# Altium project M3 ICE.PrjPcb
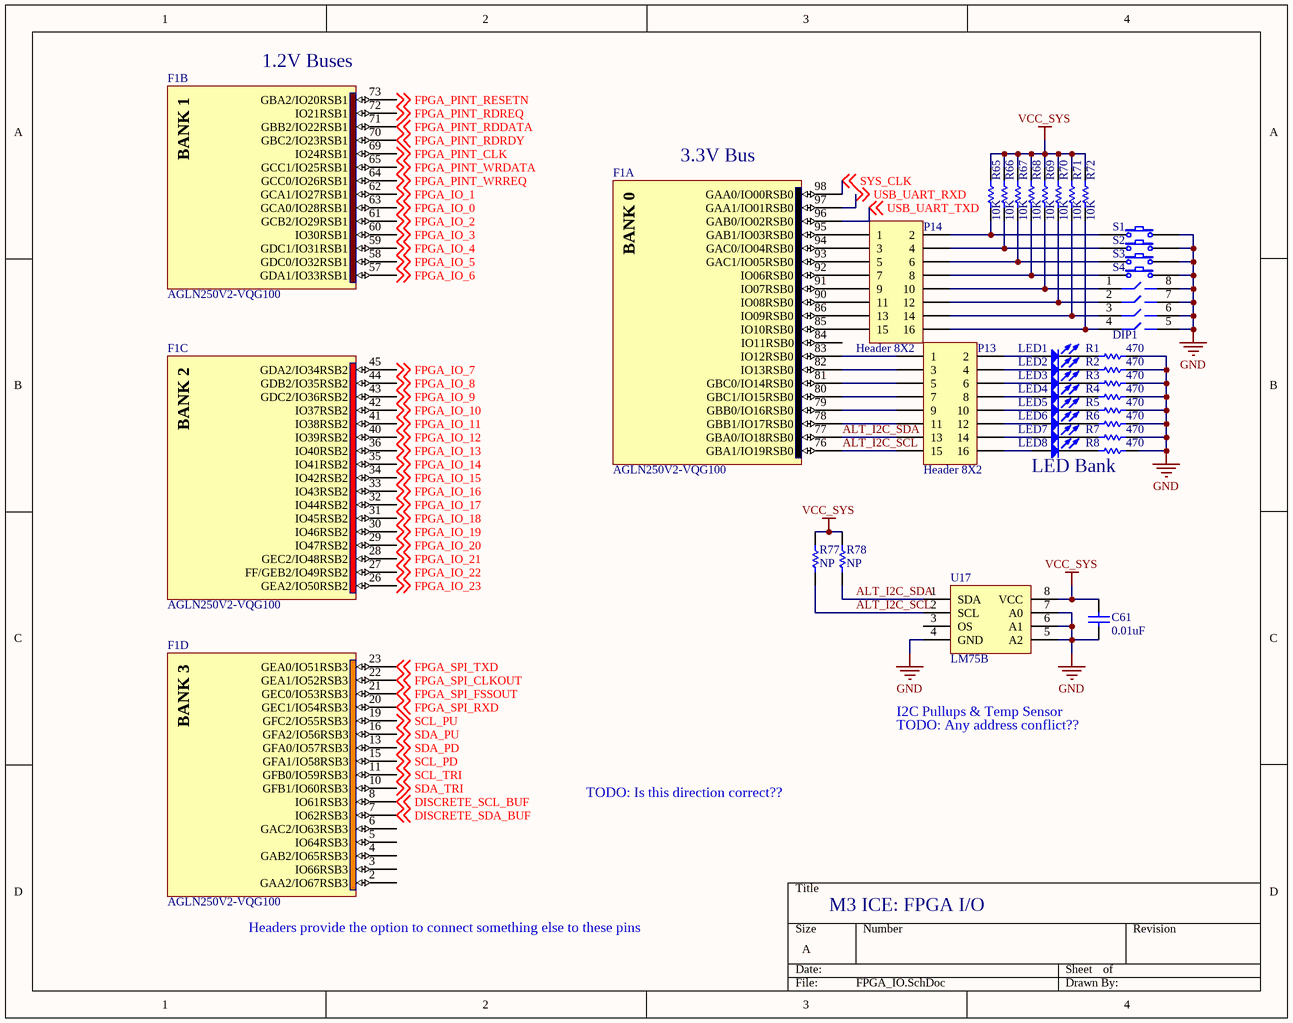
[diagram p0: FPGA_IO.SchDoc]
6 sheets, 218 parts. Net scope: global (net labels, ports and power ports of the same name join across sheets).
Board file: M3 ICE.PcbDoc
Sheets:
  FPGA_IO.SchDoc
  Power.SchDoc
  FPGA_misc.SchDoc
  USB_to_UART.SchDoc
  M3_Chip.SchDoc
  M3_Discrete_Interface.SchDoc

## Sheet FPGA_IO.SchDoc
size A

### Parts
C61  value 0.01uF  [1608[0603]]  (hidden comment: Cap Semi)
DIP1  ADE0404  [DIP-8]  (value not drawn)
F1  AGLN250V2-VQG100  [VQ100_N]  (parts A,B,C,D of 8)
LED1  LED 1206  [1206_LED]  (value not drawn)
LED2  LED 1206  [1206_LED]  (value not drawn)
LED3  LED 1206  [1206_LED]  (value not drawn)
LED4  LED 1206  [1206_LED]  (value not drawn)
LED5  LED 1206  [1206_LED]  (value not drawn)
LED6  LED 1206  [1206_LED]  (value not drawn)
LED7  LED 1206  [1206_LED]  (value not drawn)
LED8  LED 1206  [1206_LED]  (value not drawn)
P13  Header 8X2  [HDR2X8]
P14  Header 8X2  [HDR2X8]
R1  value 470  [0603]  (hidden comment: Res Chip)
R2  value 470  [0603]  (hidden comment: Res Chip)
R3  value 470  [0603]  (hidden comment: Res Chip)
R4  value 470  [0603]  (hidden comment: Res Chip)
R5  value 470  [0603]  (hidden comment: Res Chip)
R6  value 470  [0603]  (hidden comment: Res Chip)
R7  value 470  [0603]  (hidden comment: Res Chip)
R8  value 470  [0603]  (hidden comment: Res Chip)
R65  value 10K  [0603]  (hidden comment: Res Chip)
R66  value 10K  [0603]  (hidden comment: Res Chip)
R67  value 10K  [0603]  (hidden comment: Res Chip)
R68  value 10K  [0603]  (hidden comment: Res Chip)
R69  value 10K  [0603]  (hidden comment: Res Chip)
R70  value 10K  [0603]  (hidden comment: Res Chip)
R71  value 10K  [0603]  (hidden comment: Res Chip)
R72  value 10K  [0603]  (hidden comment: Res Chip)
R77  value NP  [0603]  (hidden comment: Res Chip)
R78  value NP  [0603]  (hidden comment: Res Chip)
S1  EVQ-PAE04M  [EVQPA]  (value not drawn)
S2  EVQ-PAE04M  [EVQPA]  (value not drawn)
S3  EVQ-PAE04M  [EVQPA]  (value not drawn)
S4  EVQ-PAE04M  [EVQPA]  (value not drawn)
U17  LM75B  [SO8]

### Nets
GND: C61.1 DIP1.5 DIP1.6 DIP1.7 DIP1.8 R1.1 R2.1 R3.1 R4.1 R5.1 R6.1 R7.1 R8.1 S1.2 S2.2 S3.2 S4.2 U17.4(GND) U17.5(A2) U17.6(A1) U17.7(A0)
VCC_SYS: C61.2 R65.1 R66.1 R67.1 R68.1 R69.1 R70.1 R71.1 R72.1 R77.1 R78.1 U17.8(VCC)  [project net VCC_B0]
ALT_I2C_SCL: F1.76(GBA1/IO19RSB0) P13.15 R77.2 U17.2(SCL)
ALT_I2C_SDA: F1.77(GBA0/IO18RSB0) P13.13 R78.2 U17.1(SDA)
DISCRETE_SCL_BUF: F1.8(IO61RSB3) ; off-sheet DISCRETE_SCL_BUF
DISCRETE_SDA_BUF: F1.7(IO62RSB3) ; off-sheet DISCRETE_SDA_BUF
FPGA_IO_0: F1.63(GCA0/IO28RSB1) ; off-sheet FPGA_IO_0
FPGA_IO_1: F1.62(GCA1/IO27RSB1) ; off-sheet FPGA_IO_1
FPGA_IO_2: F1.61(GCB2/IO29RSB1) ; off-sheet FPGA_IO_2
FPGA_IO_3: F1.60(IO30RSB1) ; off-sheet FPGA_IO_3
FPGA_IO_4: F1.59(GDC1/IO31RSB1) ; off-sheet FPGA_IO_4
FPGA_IO_5: F1.58(GDC0/IO32RSB1) ; off-sheet FPGA_IO_5
FPGA_IO_6: F1.57(GDA1/IO33RSB1) ; off-sheet FPGA_IO_6
FPGA_IO_7: F1.45(GDA2/IO34RSB2) ; off-sheet FPGA_IO_7
FPGA_IO_8: F1.44(GDB2/IO35RSB2) ; off-sheet FPGA_IO_8
FPGA_IO_9: F1.43(GDC2/IO36RSB2) ; off-sheet FPGA_IO_9
FPGA_IO_10: F1.42(IO37RSB2) ; off-sheet FPGA_IO_10
FPGA_IO_11: F1.41(IO38RSB2) ; off-sheet FPGA_IO_11
FPGA_IO_12: F1.40(IO39RSB2) ; off-sheet FPGA_IO_12
FPGA_IO_13: F1.36(IO40RSB2) ; off-sheet FPGA_IO_13
FPGA_IO_14: F1.35(IO41RSB2) ; off-sheet FPGA_IO_14
FPGA_IO_15: F1.34(IO42RSB2) ; off-sheet FPGA_IO_15
FPGA_IO_16: F1.33(IO43RSB2) ; off-sheet FPGA_IO_16
FPGA_IO_17: F1.32(IO44RSB2) ; off-sheet FPGA_IO_17
FPGA_IO_18: F1.31(IO45RSB2) ; off-sheet FPGA_IO_18
FPGA_IO_19: F1.30(IO46RSB2) ; off-sheet FPGA_IO_19
FPGA_IO_20: F1.29(IO47RSB2) ; off-sheet FPGA_IO_20
FPGA_IO_21: F1.28(GEC2/IO48RSB2) ; off-sheet FPGA_IO_21
FPGA_IO_22: F1.27(FF/GEB2/IO49RSB2) ; off-sheet FPGA_IO_22
FPGA_IO_23: F1.26(GEA2/IO50RSB2) ; off-sheet FPGA_IO_23
FPGA_PINT_CLK: F1.69(IO24RSB1) ; off-sheet FPGA_PINT_CLK
FPGA_PINT_RDDATA: F1.71(GBB2/IO22RSB1) ; off-sheet FPGA_PINT_RDDATA
FPGA_PINT_RDRDY: F1.70(GBC2/IO23RSB1) ; off-sheet FPGA_PINT_RDRDY
FPGA_PINT_RDREQ: F1.72(IO21RSB1) ; off-sheet FPGA_PINT_RDREQ
FPGA_PINT_RESETN: F1.73(GBA2/IO20RSB1) ; off-sheet FPGA_PINT_RESETN
FPGA_PINT_WRDATA: F1.65(GCC1/IO25RSB1) ; off-sheet FPGA_PINT_WRDATA
FPGA_PINT_WRREQ: F1.64(GCC0/IO26RSB1) ; off-sheet FPGA_PINT_WRREQ
FPGA_SPI_CLKOUT: F1.22(GEA1/IO52RSB3) ; off-sheet FPGA_SPI_CLKOUT
FPGA_SPI_FSSOUT: F1.21(GEC0/IO53RSB3) ; off-sheet FPGA_SPI_FSSOUT
FPGA_SPI_RXD: F1.20(GEC1/IO54RSB3) ; off-sheet FPGA_SPI_RXD
FPGA_SPI_TXD: F1.23(GEA0/IO51RSB3) ; off-sheet FPGA_SPI_TXD
SCL_PD: F1.15(GFA1/IO58RSB3) ; off-sheet SCL_PD
SCL_PU: F1.19(GFC2/IO55RSB3) ; off-sheet SCL_PU
SCL_TRI: F1.11(GFB0/IO59RSB3) ; off-sheet SCL_TRI
SDA_PD: F1.13(GFA0/IO57RSB3) ; off-sheet SDA_PD
SDA_PU: F1.16(GFA2/IO56RSB3) ; off-sheet SDA_PU
SDA_TRI: F1.10(GFB1/IO60RSB3) ; off-sheet SDA_TRI
SYS_CLK: F1.98(GAA0/IO00RSB0) ; off-sheet SYS_CLK
USB_UART_RXD: F1.97(GAA1/IO01RSB0) ; off-sheet USB_UART_RXD
USB_UART_TXD: F1.96(GAB0/IO02RSB0) ; off-sheet USB_UART_TXD
NetDIP1_1: DIP1.1 P14.10 R69.2
NetDIP1_2: DIP1.2 P14.12 R70.2
NetDIP1_3: DIP1.3 P14.14 R71.2
NetDIP1_4: DIP1.4 P14.16 R72.2
NetF1_78: F1.78(GBB1/IO17RSB0) P13.11
NetF1_79: F1.79(GBB0/IO16RSB0) P13.9
NetF1_80: F1.80(GBC1/IO15RSB0) P13.7
NetF1_81: F1.81(GBC0/IO14RSB0) P13.5
NetF1_82: F1.82(IO13RSB0) P13.3
NetF1_83: F1.83(IO12RSB0) P13.1
NetF1_85: F1.85(IO10RSB0) P14.15
NetF1_86: F1.86(IO09RSB0) P14.13
NetF1_90: F1.90(IO08RSB0) P14.11
NetF1_91: F1.91(IO07RSB0) P14.9
NetF1_92: F1.92(IO06RSB0) P14.7
NetF1_93: F1.93(GAC1/IO05RSB0) P14.5
NetF1_94: F1.94(GAC0/IO04RSB0) P14.3
NetF1_95: F1.95(GAB1/IO03RSB0) P14.1
NetLED1_1: LED1.1(A) P13.2
NetLED1_2: LED1.2(K) R1.2
NetLED2_1: LED2.1(A) P13.4
NetLED2_2: LED2.2(K) R2.2
NetLED3_1: LED3.1(A) P13.6
NetLED3_2: LED3.2(K) R3.2
NetLED4_1: LED4.1(A) P13.8
NetLED4_2: LED4.2(K) R4.2
NetLED5_1: LED5.1(A) P13.10
NetLED5_2: LED5.2(K) R5.2
NetLED6_1: LED6.1(A) P13.12
NetLED6_2: LED6.2(K) R6.2
NetLED7_1: LED7.1(A) P13.14
NetLED7_2: LED7.2(K) R7.2
NetLED8_1: LED8.1(A) P13.16
NetLED8_2: LED8.2(K) R8.2
NetP14_2: P14.2 R65.2 S1.1
NetP14_4: P14.4 R66.2 S2.1
NetP14_6: P14.6 R67.2 S3.1
NetP14_8: P14.8 R68.2 S4.1

Not connected (* = marked no-connect by the designer): F1 2(GAA2/IO67RSB3) 3(IO66RSB3) 4(GAB2/IO65RSB3) 5(IO64RSB3) 6(GAC2/IO63RSB3) 84(IO11RSB0); U17 3(OS)

### Notes on the sheet
- (near F1) 1.2V Buses
- (near F1) 3.3V Bus
- LED Bank
- I2C Pullups & Temp Sensor
- TODO: Any address conflict??
- TODO: Is this direction correct??
- M3 ICE: FPGA I/O
- (near F1) Headers provide the option to connect something else to these pins
- (in symbol AGLN250V2-VQG100, part A) BANK 0
- (in symbol AGLN250V2-VQG100, part B) BANK 1
- (in symbol AGLN250V2-VQG100, part C) BANK 2
- (in symbol AGLN250V2-VQG100, part D) BANK 3

### Library data of the parts
C61 = Cap Semi: Capacitor (Semiconductor SIM Model); Published: 8-Jun-2000; LatestRevisionDate: 29-May-2009; LatestRevisionNote: IPC-7351 Footprint Added.; PackageReference: C1206; Publisher: Altium Limited; PackageDescription: Chip Capacitor
DIP1 = ADE0404: 4-DIP Switch; Published: 24-Mar-1999; LatestRevisionDate: 17-Jul-2002; LatestRevisionNote: Re-released for DXP Platform.; PackageReference: DIP-8; Publisher: Altium Limited
F1 = AGLN250V2-VQG100: IGLOO nano Low-Power Flash 1.2 to 1.5V FPGA with Flash*Freeze, 68 User IOs, 250K System Gates, 1Kbit Flash ROM, 100-Pin TQFP, Commercial Grade, Pb-Free; Published: 29-May-2009; DatasheetVersion: Feb-2009; PackageVersion: v11.0, Feb-2009; PackageReference: VQ100; Publisher: Altium Limited; PackageDescription: 100-Pin Plastic Quad Flat Pack (VQ100); Code_JEDEC: MS-026-AED; ComponentLink1Description: Manufacturer Link; ComponentLink1URL: http://www.actel.com/products/igloonano/default.aspx; ComponentLink2Description: Datasheet; ComponentLink2URL: http://www.actel.com/documents/IGLOO_nano_DS.pdf
P13 P14 = Header 8X2: Header, 8-Pin, Dual row; LatestRevisionDate: 17-Jul-2002; LatestRevisionNote: Re-released for DXP Platform.; Publisher: Altium Limited
R1-R8 R65-R72 R77 R78 = Res Chip: Semiconductor Resistor; Published: 8-Jun-2000; LatestRevisionDate: 17-Jul-2002; LatestRevisionNote: Re-released for DXP Platform.; PackageReference: AXIAL-0.5; Publisher: Altium Limited; PackageDescription: Axial Device, Thru-Hole; 2 Leads; 0.5 in Pin Spacing
S1-S4 = EVQ-PAE04M: Switch Push; Published: 24-Mar-1999; LatestRevisionDate: 17-Jul-2002; LatestRevisionNote: Re-released for DXP Platform.; PackageReference: SPST-2; Publisher: Altium Limited; PackageDescription: Switch; 2 Leads
U17 = LM75B: I2C Temp Sensor

## Sheet Power.SchDoc
size A
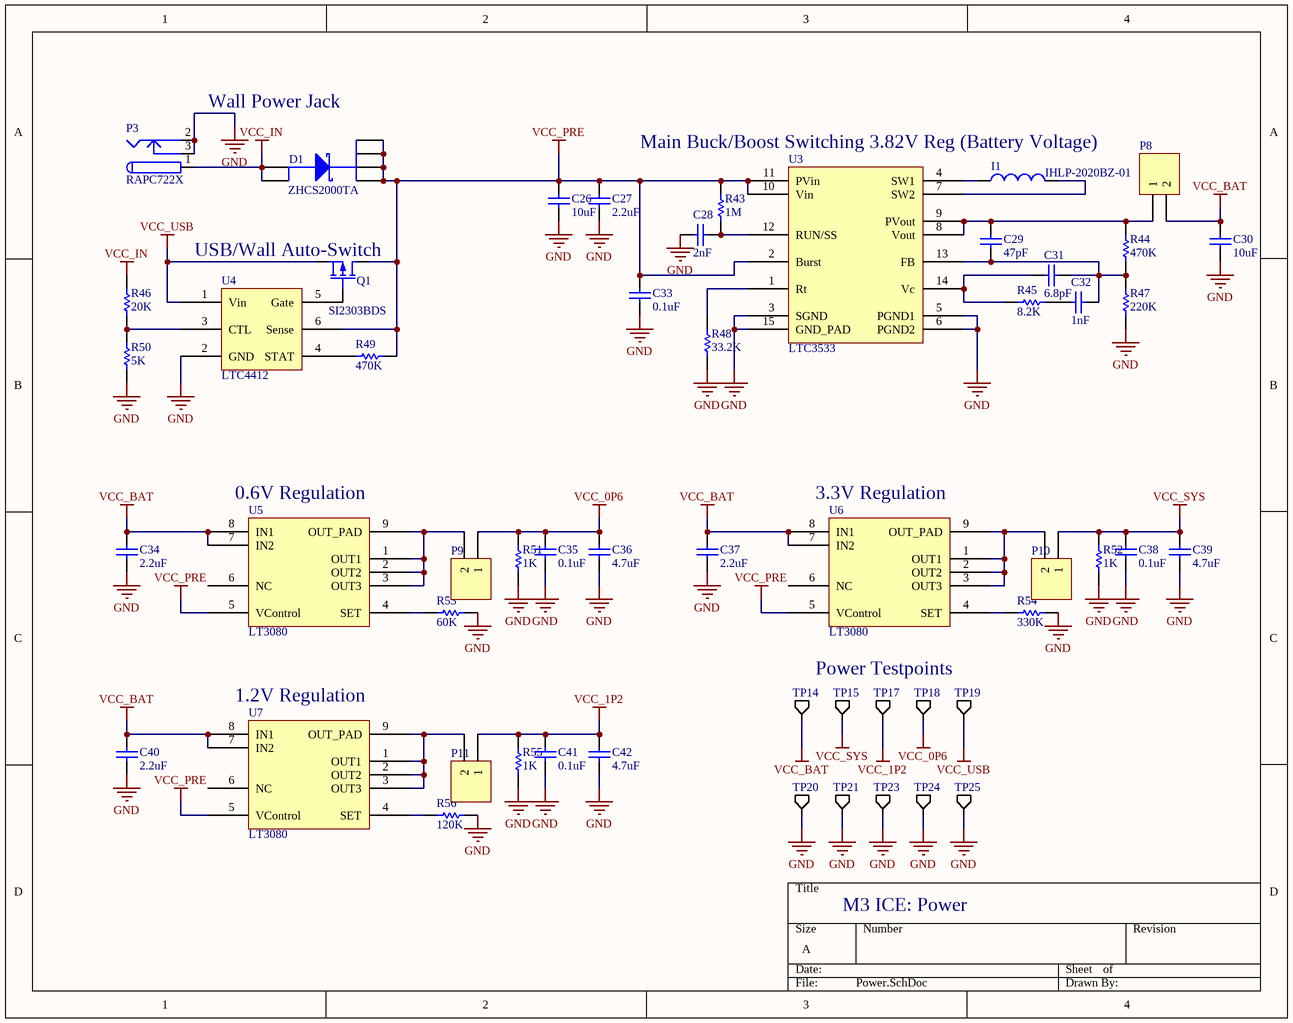
[diagram p1: Power.SchDoc]

### Parts
C26  value 10uF  [0805]  (hidden comment: Cap Chip)
C27  value 2.2uF  [1608[0603]]  (hidden comment: Cap Semi)
C28  value 2nF  [1608[0603]]  (hidden comment: Cap Semi)
C29  value 47pF  [1608[0603]]  (hidden comment: Cap Semi)
C30  value 10uF  [0805]  (hidden comment: Cap Chip)
C31  value 6.8pF  [1608[0603]]  (hidden comment: Cap Semi)
C32  value 1nF  [1608[0603]]  (hidden comment: Cap Semi)
C33  value 0.1uF  [1608[0603]]  (hidden comment: Cap Semi)
C34  value 2.2uF  [1608[0603]]  (hidden comment: Cap Semi)
C35  value 0.1uF  [1608[0603]]  (hidden comment: Cap Semi)
C36  value 4.7uF  [0805]  (hidden comment: Cap Chip)
C37  value 2.2uF  [1608[0603]]  (hidden comment: Cap Semi)
C38  value 0.1uF  [1608[0603]]  (hidden comment: Cap Semi)
C39  value 4.7uF  [0805]  (hidden comment: Cap Chip)
C40  value 2.2uF  [1608[0603]]  (hidden comment: Cap Semi)
C41  value 0.1uF  [1608[0603]]  (hidden comment: Cap Semi)
C42  value 4.7uF  [0805]  (hidden comment: Cap Chip)
D1  ZHCS2000TA  [SOT23-6_L]
I1  IHLP-2020BZ-01  [INDUCTOR_5.49mm_5.18mm]
P3  RAPC722X  [RAPC722X]
P8  Header 2  [HDR1X2]  (value not drawn)
P9  Header 2  [HDR1X2]  (value not drawn)
P10  Header 2  [HDR1X2]  (value not drawn)
P11  Header 2  [HDR1X2]  (value not drawn)
Q1  SI2303BDS  [SOT-23_N]
R43  value 1M  [0603]  (hidden comment: Res Chip)
R44  value 470K  [0603]  (hidden comment: Res Chip)
R45  value 8.2K  [0603]  (hidden comment: Res Chip)
R46  value 20K  [0603]  (hidden comment: Res Chip)
R47  value 220K  [0603]  (hidden comment: Res Chip)
R48  value 33.2K  [0603]  (hidden comment: Res Chip)
R49  value 470K  [0603]  (hidden comment: Res Chip)
R50  value 5K  [0603]  (hidden comment: Res Chip)
R51  value 1K  [0603]  (hidden comment: Res Chip)
R52  value 1K  [0603]  (hidden comment: Res Chip)
R53  value 60K  [0603]  (hidden comment: Res Chip)
R54  value 330K  [0603]  (hidden comment: Res Chip)
R55  value 1K  [0603]  (hidden comment: Res Chip)
R56  value 120K  [0603]  (hidden comment: Res Chip)
TP14  TP  [TP]  (value not drawn)
TP15  TP  [TP]  (value not drawn)
TP17  TP  [TP]  (value not drawn)
TP18  TP  [TP]  (value not drawn)
TP19  TP  [TP]  (value not drawn)
TP20  TP  [TP]  (value not drawn)
TP21  TP  [TP]  (value not drawn)
TP23  TP  [TP]  (value not drawn)
TP24  TP  [TP]  (value not drawn)
TP25  TP  [TP]  (value not drawn)
U3  LTC3533  [14-WFDFN]
U4  LTC4412  [SOT23-6_L]
U5  LT3080  [MSOP-8]
U6  LT3080  [MSOP-8]
U7  LT3080  [MSOP-8]

### Nets
GND: C26.1 C27.1 C28.2 C30.1 C33.1 C34.1 C35.1 C36.1 C37.1 C38.1 C39.1 C40.1 C41.1 C42.1 P3.2 P3.3 R47.2 R48.1 R50.1 R51.1 R52.1 R53.1 R54.1 R55.1 R56.1 TP20.1(A) TP21.1(A) TP23.1(A) TP24.1(A) TP25.1(A) U3.3(SGND) U3.5(PGND1) U3.6(PGND2) U3.15(GND_PAD) U4.2(GND)
VCC_0P6: C35.2 C36.2 P9.1 R51.2 TP18.1(A)
VCC_1P2: C41.2 C42.2 P11.1 R55.2 TP17.1(A)
VCC_BAT: C30.2 C34.2 C37.2 C40.2 P8.2 TP14.1(A) U5.7(IN2) U5.8(IN1) U6.7(IN2) U6.8(IN1) U7.7(IN2) U7.8(IN1)
VCC_IN: D1.3(A) D1.4(A) P3.1 R46.2
VCC_PRE: C26.2 C27.2 C33.2 D1.1(K) D1.2(K) D1.5(K) D1.6(K) Q1.3(D) R43.2 R49.1 U3.2(Burst) U3.10(Vin) U3.11(PVin) U4.6(Sense) U5.5(VControl) U6.5(VControl) U7.5(VControl)
VCC_SYS: C38.2 C39.2 P10.1 R52.2 TP15.1(A)  [project net VCC_B0]
VCC_USB: Q1.2(S) TP19.1(A) U4.1(Vin)
NetC28_1: C28.1 R43.1 U3.12(RUN/SS)
NetC29_1: C29.1 C31.1 C32.1 R44.1 R47.1 U3.13(FB)
NetC29_2: C29.2 P8.1 R44.2 U3.8(Vout) U3.9(PVout)
NetC31_2: C31.2 R45.2 U3.14(Vc)
NetC32_2: C32.2 R45.1
NetI1_1: I1.1 U3.4(SW1)
NetI1_2: I1.2 U3.7(SW2)
NetP9_2: P9.2 U5.1(OUT1) U5.2(OUT2) U5.3(OUT3) U5.9(OUT_PAD)
NetP10_2: P10.2 U6.1(OUT1) U6.2(OUT2) U6.3(OUT3) U6.9(OUT_PAD)
NetP11_2: P11.2 U7.1(OUT1) U7.2(OUT2) U7.3(OUT3) U7.9(OUT_PAD)
NetQ1_1: Q1.1(G) U4.5(Gate)
NetR46_1: R46.1 R50.2 U4.3(CTL)
NetR48_2: R48.2 U3.1(Rt)
NetR49_2: R49.2 U4.4(STAT)
NetR53_2: R53.2 U5.4(SET)
NetR54_2: R54.2 U6.4(SET)
NetR56_2: R56.2 U7.4(SET)

Not connected (* = marked no-connect by the designer): U5 6(NC); U6 6(NC); U7 6(NC)

### Notes on the sheet
- Wall Power Jack
- Main Buck/Boost Switching 3.82V Reg (Battery Voltage)
- (near Q1) USB/Wall Auto-Switch
- (near U5) 0.6V Regulation
- (near U6) 3.3V Regulation
- (near U7) 1.2V Regulation
- Power Testpoints
- M3 ICE: Power

### Library data of the parts
C26 C30 C36 C39 C42 = Cap Chip: Capacitor (Semiconductor SIM Model); Published: 8-Jun-2000; LatestRevisionDate: 29-May-2009; LatestRevisionNote: IPC-7351 Footprint Added.; PackageReference: C1206; Publisher: Altium Limited; PackageDescription: Chip Capacitor
C27-C29 C31-C35 C37 C38 C40 C41 = Cap Semi: Capacitor (Semiconductor SIM Model); Published: 8-Jun-2000; LatestRevisionDate: 29-May-2009; LatestRevisionNote: IPC-7351 Footprint Added.; PackageReference: C1206; Publisher: Altium Limited; PackageDescription: Chip Capacitor
D1 = ZHCS2000TA: Schottky Diode; Published: 8-Jun-2000; LatestRevisionDate: 17-Jul-2002; LatestRevisionNote: Re-released for DXP Platform.; PackageReference: SMB; Publisher: Altium Limited; PackageDescription: DO-214-AA/SMB; 2 C-Bend Leads; Body 5.3 x 3.6 mm, inc. leads (LxW); Code_JEDEC: DO-214-AA
I1 = Inductor IHLP-2020BZ-01: IHLP2020BZER2R2M01
P3 = RAPC722X: CONN POWERJACK MINI R/A T/H
P8-P11 = Header 2: Header, 2-Pin; LatestRevisionDate: 17-Jul-2002; LatestRevisionNote: Re-released for DXP Platform.; Publisher: Altium Limited
Q1 = SI2303BDS: P-Channel MOSFET
R43-R56 = Res Chip: Semiconductor Resistor; Published: 8-Jun-2000; LatestRevisionDate: 17-Jul-2002; LatestRevisionNote: Re-released for DXP Platform.; PackageReference: AXIAL-0.5; Publisher: Altium Limited; PackageDescription: Axial Device, Thru-Hole; 2 Leads; 0.5 in Pin Spacing

## Sheet FPGA_misc.SchDoc
size A
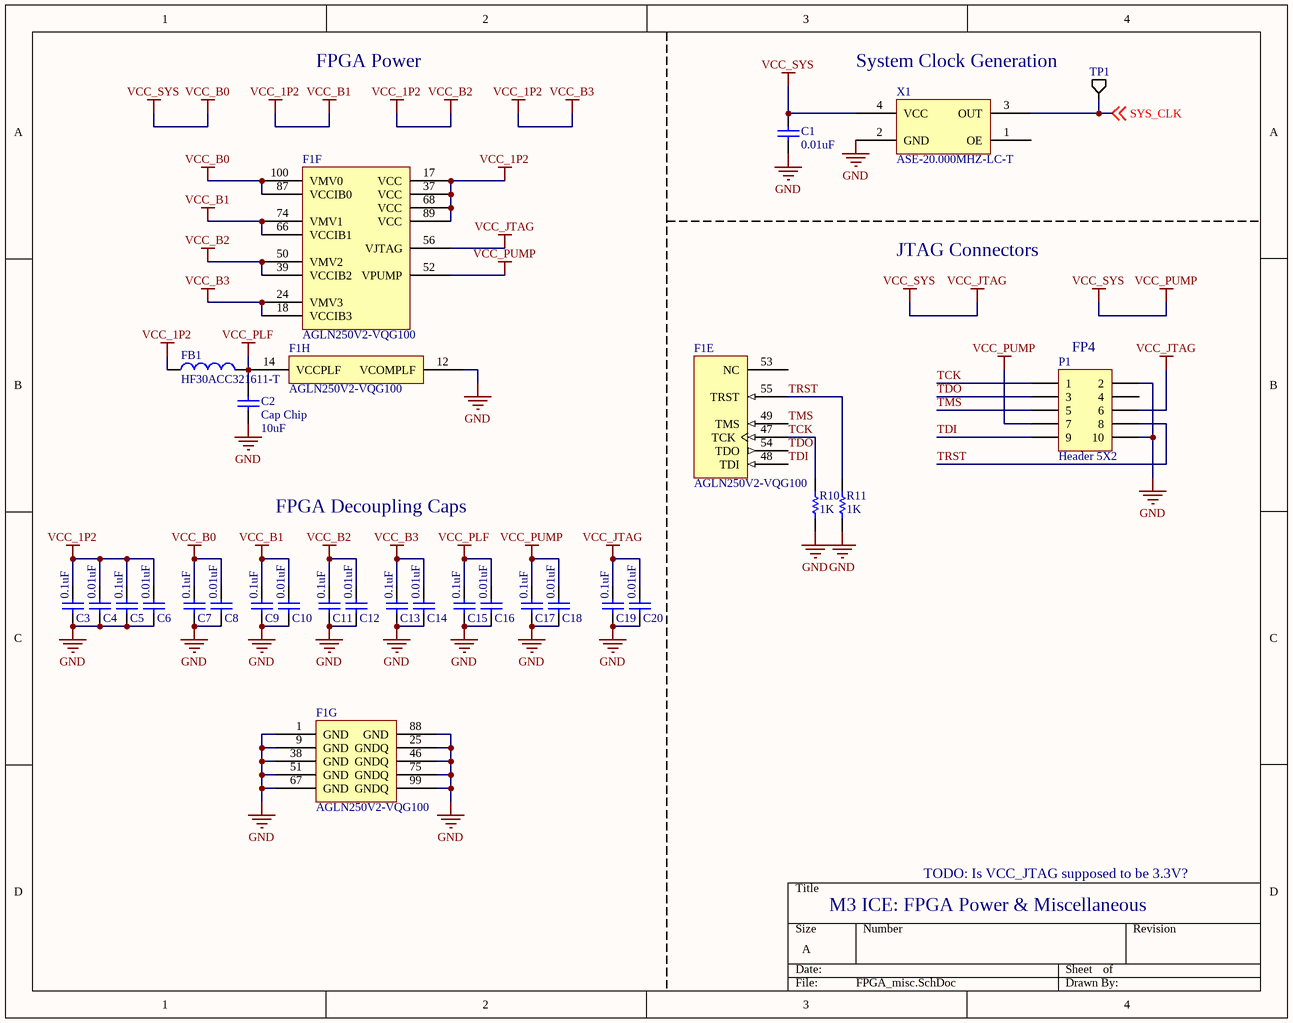
[diagram p2: FPGA_misc.SchDoc]

### Parts
C1  value 0.01uF  [1608[0603]]  (hidden comment: Cap Semi)
C2  Cap Chip  value 10uF  [0805]
C3  value 0.1uF  [1608[0603]]  (hidden comment: Cap Semi)
C4  value 0.01uF  [1608[0603]]  (hidden comment: Cap Semi)
C5  value 0.1uF  [1608[0603]]  (hidden comment: Cap Semi)
C6  value 0.01uF  [1608[0603]]  (hidden comment: Cap Semi)
C7  value 0.1uF  [1608[0603]]  (hidden comment: Cap Semi)
C8  value 0.01uF  [1608[0603]]  (hidden comment: Cap Semi)
C9  value 0.1uF  [1608[0603]]  (hidden comment: Cap Semi)
C10  value 0.01uF  [1608[0603]]  (hidden comment: Cap Semi)
C11  value 0.1uF  [1608[0603]]  (hidden comment: Cap Semi)
C12  value 0.01uF  [1608[0603]]  (hidden comment: Cap Semi)
C13  value 0.1uF  [1608[0603]]  (hidden comment: Cap Semi)
C14  value 0.01uF  [1608[0603]]  (hidden comment: Cap Semi)
C15  value 0.1uF  [1608[0603]]  (hidden comment: Cap Semi)
C16  value 0.01uF  [1608[0603]]  (hidden comment: Cap Semi)
C17  value 0.1uF  [1608[0603]]  (hidden comment: Cap Semi)
C18  value 0.01uF  [1608[0603]]  (hidden comment: Cap Semi)
C19  value 0.1uF  [1608[0603]]  (hidden comment: Cap Semi)
C20  value 0.01uF  [1608[0603]]  (hidden comment: Cap Semi)
F1  AGLN250V2-VQG100  [VQ100_N]  (parts E,F,G,H of 8)
FB1  HF30ACC321611-T  [Ferrite_Bead_3.2mm_1.6mm]
P1  Header 5X2  [HDR2X5]
R10  value 1K  [0603]  (hidden comment: Res Chip)
R11  value 1K  [0603]  (hidden comment: Res Chip)
TP1  TP  [TP]  (value not drawn)
X1  ASE-20.000MHZ-LC-T  [CRYSTAL_3.2mm_2.5mm]

### Nets
GND: C1.1 C2.1 C3.1 C4.1 C5.1 C6.1 C7.1 C8.1 C9.1 C10.1 C11.1 C12.1 C13.1 C14.1 C15.1 C16.1 C17.1 C18.1 C19.1 C20.1 F1.1(GND) F1.9(GND) F1.12(VCOMPLF) F1.25(GNDQ) F1.38(GND) F1.46(GNDQ) F1.51(GND) F1.67(GND) F1.75(GNDQ) F1.88(GND) F1.99(GNDQ) P1.2 P1.10 R10.2 R11.2 X1.2(GND)
VCC_1P2: C3.2 C4.2 C5.2 C6.2 C9.2 C10.2 C11.2 C12.2 C13.2 C14.2 F1.17(VCC) F1.18(VCCIB3) F1.24(VMV3) F1.37(VCC) F1.39(VCCIB2) F1.50(VMV2) F1.66(VCCIB1) F1.68(VCC) F1.74(VMV1) F1.89(VCC) FB1.1  [also labelled VCC_B1, VCC_B2, VCC_B3]
VCC_B0: C1.2 C7.2 C8.2 C17.2 C18.2 C19.2 C20.2 F1.52(VPUMP) F1.56(VJTAG) F1.87(VCCIB0) F1.100(VMV0) P1.6 P1.7 X1.4(VCC)  [also labelled VCC_JTAG, VCC_PUMP, VCC_SYS]
VCC_PLF: C2.2 C15.2 C16.2 F1.14(VCCPLF) FB1.2
SYS_CLK: TP1.1(A) X1.3(OUT) ; off-sheet SYS_CLK
TCK: F1.47(TCK) P1.1 R10.1
TDI: F1.48(TDI) P1.9
TDO: F1.54(TDO) P1.3
TMS: F1.49(TMS) P1.5
TRST: F1.55(TRST) P1.8 R11.1

Not connected (* = marked no-connect by the designer): F1 53(NC); P1 4; X1 1(OE)

### Notes on the sheet
- FPGA Power
- System Clock Generation
- JTAG Connectors
- (near P1) FP4
- FPGA Decoupling Caps
- M3 ICE: FPGA Power & Miscellaneous
- TODO: Is VCC_JTAG supposed to be 3.3V?

### Library data of the parts
C1 C3-C20 = Cap Semi: Capacitor (Semiconductor SIM Model); Published: 8-Jun-2000; LatestRevisionDate: 29-May-2009; LatestRevisionNote: IPC-7351 Footprint Added.; PackageReference: C1206; Publisher: Altium Limited; PackageDescription: Chip Capacitor
C2 = Cap Chip: Capacitor (Semiconductor SIM Model); Published: 8-Jun-2000; LatestRevisionDate: 29-May-2009; LatestRevisionNote: IPC-7351 Footprint Added.; PackageReference: C1206; Publisher: Altium Limited; PackageDescription: Chip Capacitor
F1 = AGLN250V2-VQG100: as F1 on sheet FPGA_IO; Published: 29-May-2009; DatasheetVersion: Feb-2009; PackageVersion: v11.0, Feb-2009; PackageReference: VQ100; Publisher: Altium Limited; PackageDescription: 100-Pin Plastic Quad Flat Pack (VQ100); Code_JEDEC: MS-026-AED; ComponentLink1Description: Manufacturer Link; ComponentLink1URL: http://www.actel.com/products/igloonano/default.aspx; ComponentLink2Description: Datasheet; ComponentLink2URL: http://www.actel.com/documents/IGLOO_nano_DS.pdf
FB1 = Ferrite Bead HF30ACC321611-T
P1 = Header 5X2: Header, 5-Pin, Dual row; LatestRevisionDate: 17-Jul-2002; LatestRevisionNote: Re-released for DXP Platform.; Publisher: Altium Limited
R10 R11 = Res Chip: Semiconductor Resistor; Published: 8-Jun-2000; LatestRevisionDate: 17-Jul-2002; LatestRevisionNote: Re-released for DXP Platform.; PackageReference: AXIAL-0.5; Publisher: Altium Limited; PackageDescription: Axial Device, Thru-Hole; 2 Leads; 0.5 in Pin Spacing

## Sheet USB_to_UART.SchDoc
size A
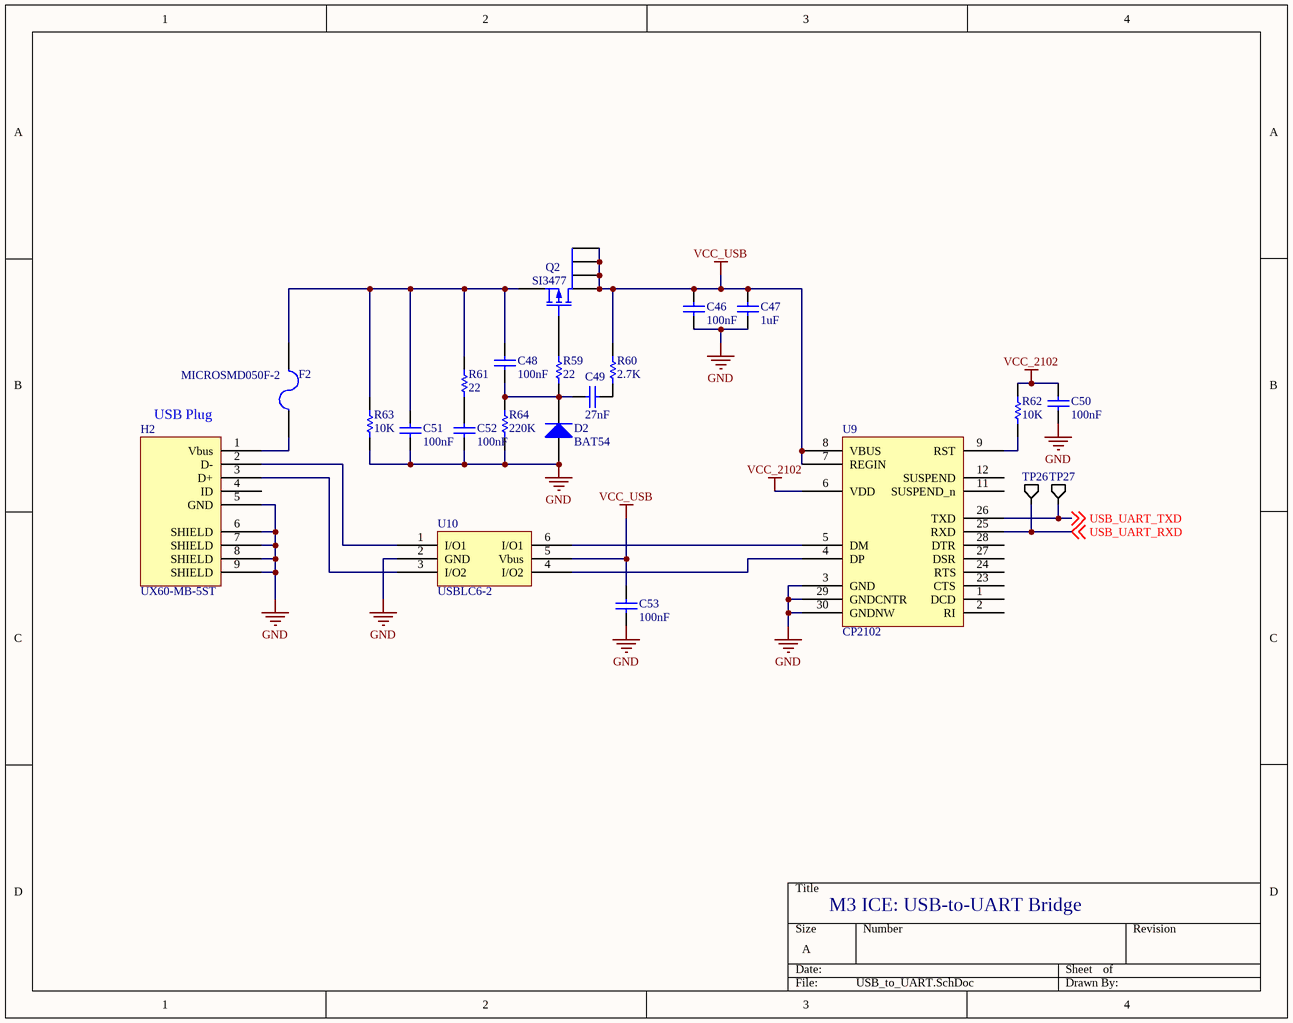
[diagram p3: USB_to_UART.SchDoc]

### Parts
C46  value 100nF  [1608[0603]]  (hidden comment: Cap Semi)
C47  value 1uF  [1608[0603]]  (hidden comment: Cap Semi)
C48  value 100nF  [1608[0603]]  (hidden comment: Cap Semi)
C49  value 27nF  [1608[0603]]  (hidden comment: Cap Semi)
C50  value 100nF  [1608[0603]]  (hidden comment: Cap Semi)
C51  value 100nF  [1608[0603]]  (hidden comment: Cap Semi)
C52  value 100nF  [1608[0603]]  (hidden comment: Cap Semi)
C53  value 100nF  [1608[0603]]  (hidden comment: Cap Semi)
D2  BAT54  [SOT-23_N]
F2  MICROSMD050F-2  [1210]
H2  UX60-MB-5ST  [USB Mini-B]
Q2  SI3477  [TSOP-6]
R59  value 22  [0603]  (hidden comment: Res Chip)
R60  value 2.7K  [0603]  (hidden comment: Res Chip)
R61  value 22  [0603]  (hidden comment: Res Chip)
R62  value 10K  [0603]  (hidden comment: Res Chip)
R63  value 10K  [0603]  (hidden comment: Res Chip)
R64  value 220K  [0603]  (hidden comment: Res Chip)
TP26  TP  [TP]  (value not drawn)
TP27  TP  [TP]  (value not drawn)
U9  CP2102  [QFN-28]
U10  USBLC6-2  [SOT23-6_L]

### Nets
GND: C46.1 C47.1 C50.1 C51.1 C52.1 C53.1 D2.1(A) H2.5(GND) H2.6(SHIELD) H2.7(SHIELD) H2.8(SHIELD) H2.9(SHIELD) R63.1 R64.1 U9.3(GND) U9.29(GNDCNTR) U9.30(GNDNW) U10.2(GND)
VCC_2102: C50.2 R62.2 U9.6(VDD)
VCC_USB: C46.2 C47.2 C53.2 Q2.1(D) Q2.2(D) Q2.5(D) Q2.6(D) R60.2 U9.7(REGIN) U9.8(VBUS) U10.5(Vbus)
USB_UART_RXD: TP26.1(A) U9.25(RXD) ; off-sheet USB_UART_RXD
USB_UART_TXD: TP27.1(A) U9.26(TXD) ; off-sheet USB_UART_TXD
NetC48_1: C48.1 C49.2 D2.3(K) R59.1 R64.2
NetC48_2: C48.2 C51.2 F2.2 Q2.4(S) R61.2 R63.2
NetC49_1: C49.1 R60.1
NetC52_2: C52.2 R61.1
NetF2_1: F2.1 H2.1(Vbus)
NetH2_2: H2.2(D-) U10.1(I/O1)
NetH2_3: H2.3(D+) U10.3(I/O2)
NetQ2_3: Q2.3(G) R59.2
NetR62_1: R62.1 U9.9(RST)
NetU9_4: U9.4(DP) U10.4(I/O2)
NetU9_5: U9.5(DM) U10.6(I/O1)

Not connected (* = marked no-connect by the designer): H2 4(ID); U9 1(DCD) 2(RI) 11(SUSPEND_n) 12(SUSPEND) 23(CTS) 24(RTS) 27(DSR) 28(DTR)

### Notes on the sheet
- (near H2) USB Plug
- M3 ICE: USB-to-UART Bridge

### Library data of the parts
C46-C53 = Cap Semi: Capacitor (Semiconductor SIM Model); Published: 8-Jun-2000; LatestRevisionDate: 29-May-2009; LatestRevisionNote: IPC-7351 Footprint Added.; PackageReference: C1206; Publisher: Altium Limited; PackageDescription: Chip Capacitor
D2 = Diode BAT18: Low-Loss RF Switching Diode; Note: Pin 2 is not connected and not drawn.; Published: 21-Mar-2003; LatestRevisionDate: 29-May-2009; LatestRevisionNote: IPC-7351 Footprint Added.; DatasheetVersion: Oct-1999; PackageVersion: Sep-2001; PackageReference: SOT-23; Publisher: Altium Limited; PackageDescription: 3-Pin SOT-23 Package 0.95 mm Pitch, 2.5 mm Lead Span; ComponentLink1Description: Manufacturer Link; ComponentLink1URL: http://www.infineon.com/
F2 = Fuse MICROSMD050F-2: POLYSWITCH 0.50A RESET FUSE SMD; Published: 8-Jun-2000; LatestRevisionDate: 17-Jul-2002; LatestRevisionNote: Re-released for DXP Platform.; PackageReference: PIN-W2/E2.8; Publisher: Altium Limited; PackageDescription: Thru-Hole; 2 Leads
H2 = UX60-MB-5ST: USB mini-B
Q2 = SI3477: P-Channel MOSFET; Published: 8-Jun-2000; LatestRevisionDate: 17-Jul-2002; LatestRevisionNote: Re-released for DXP Platform.; PackageVersion: 1995/1996; PackageReference: E3; Publisher: Altium Limited; PackageDescription: TO, Flat Index; 3 In-Line, Axial Leads; Body Dia. 4.6mm; Lead Dia. 0.5 mm (max)
R59-R64 = Res Chip: Semiconductor Resistor; Published: 8-Jun-2000; LatestRevisionDate: 17-Jul-2002; LatestRevisionNote: Re-released for DXP Platform.; PackageReference: AXIAL-0.5; Publisher: Altium Limited; PackageDescription: Axial Device, Thru-Hole; 2 Leads; 0.5 in Pin Spacing
U10 = USBLC6-2: USB ESD Protection

## Sheet M3_Chip.SchDoc
size A
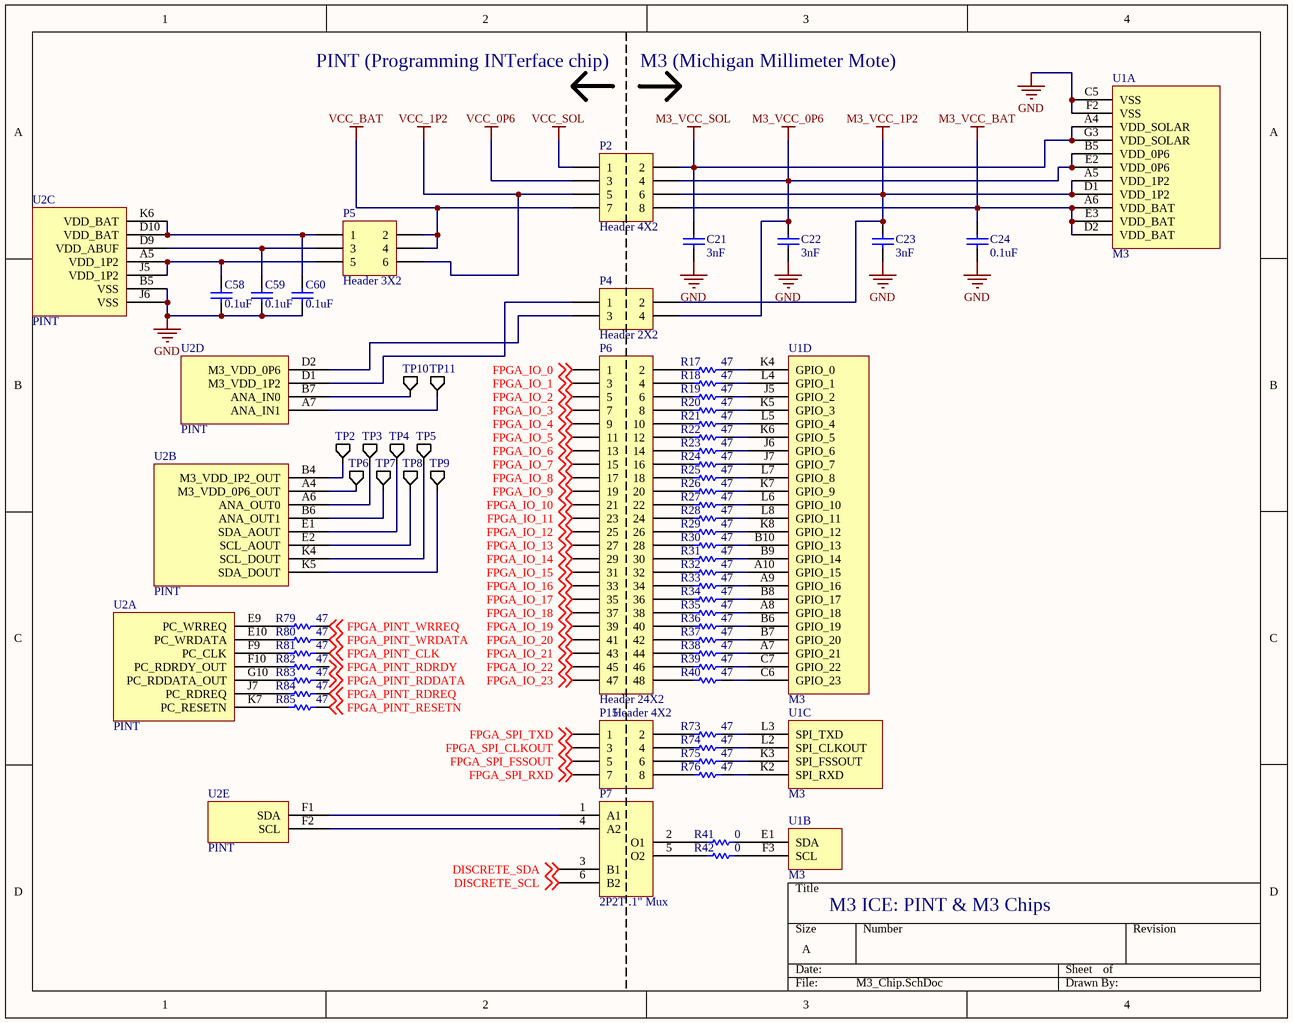
[diagram p4: M3_Chip.SchDoc]

### Parts
C21  value 3nF  [1608[0603]]  (hidden comment: Cap Semi)
C22  value 3nF  [1608[0603]]  (hidden comment: Cap Semi)
C23  value 3nF  [1608[0603]]  (hidden comment: Cap Semi)
C24  value 0.1uF  [1608[0603]]  (hidden comment: Cap Semi)
C58  value 0.1uF  [1608[0603]]  (hidden comment: Cap Semi)
C59  value 0.1uF  [1608[0603]]  (hidden comment: Cap Semi)
C60  value 0.1uF  [1608[0603]]  (hidden comment: Cap Semi)
P2  Header 4X2  [HDR2X4]
P4  Header 2X2  [HDR2X2]
P5  Header 3X2  [HDR2X3]
P6  Header 24X2  [HDR2X24]
P7  2P2T .1" Mux  [HDR3x2]
P15  Header 4X2  [HDR2X4]
R17  value 47  [0603]  (hidden comment: Res Chip)
R18  value 47  [0603]  (hidden comment: Res Chip)
R19  value 47  [0603]  (hidden comment: Res Chip)
R20  value 47  [0603]  (hidden comment: Res Chip)
R21  value 47  [0603]  (hidden comment: Res Chip)
R22  value 47  [0603]  (hidden comment: Res Chip)
R23  value 47  [0603]  (hidden comment: Res Chip)
R24  value 47  [0603]  (hidden comment: Res Chip)
R25  value 47  [0603]  (hidden comment: Res Chip)
R26  value 47  [0603]  (hidden comment: Res Chip)
R27  value 47  [0603]  (hidden comment: Res Chip)
R28  value 47  [0603]  (hidden comment: Res Chip)
R29  value 47  [0603]  (hidden comment: Res Chip)
R30  value 47  [0603]  (hidden comment: Res Chip)
R31  value 47  [0603]  (hidden comment: Res Chip)
R32  value 47  [0603]  (hidden comment: Res Chip)
R33  value 47  [0603]  (hidden comment: Res Chip)
R34  value 47  [0603]  (hidden comment: Res Chip)
R35  value 47  [0603]  (hidden comment: Res Chip)
R36  value 47  [0603]  (hidden comment: Res Chip)
R37  value 47  [0603]  (hidden comment: Res Chip)
R38  value 47  [0603]  (hidden comment: Res Chip)
R39  value 47  [0603]  (hidden comment: Res Chip)
R40  value 47  [0603]  (hidden comment: Res Chip)
R41  value 0  [0603]  (hidden comment: Res Chip)
R42  value 0  [0603]  (hidden comment: Res Chip)
R73  value 47  [0603]  (hidden comment: Res Chip)
R74  value 47  [0603]  (hidden comment: Res Chip)
R75  value 47  [0603]  (hidden comment: Res Chip)
R76  value 47  [0603]  (hidden comment: Res Chip)
R79  value 47  [0603]  (hidden comment: Res Chip)
R80  value 47  [0603]  (hidden comment: Res Chip)
R81  value 47  [0603]  (hidden comment: Res Chip)
R82  value 47  [0603]  (hidden comment: Res Chip)
R83  value 47  [0603]  (hidden comment: Res Chip)
R84  value 47  [0603]  (hidden comment: Res Chip)
R85  value 47  [0603]  (hidden comment: Res Chip)
TP2  TP  [TP]  (value not drawn)
TP3  TP  [TP]  (value not drawn)
TP4  TP  [TP]  (value not drawn)
TP5  TP  [TP]  (value not drawn)
TP6  TP  [TP]  (value not drawn)
TP7  TP  [TP]  (value not drawn)
TP8  TP  [TP]  (value not drawn)
TP9  TP  [TP]  (value not drawn)
TP10  TP  [TP]  (value not drawn)
TP11  TP  [TP]  (value not drawn)
U1  M3  [CPGA-84]  (parts A,B,C,D of 4)
U2  PINT  [CPGA-65]  (parts A,B,C,D,E of 5)

### Nets
GND: C21.1 C22.1 C23.1 C24.1 C58.1 C59.1 C60.1 U1.C5(VSS) U1.F2(VSS) U2.B5(VSS) U2.J6(VSS)
M3_VCC_0P6: C22.2 P2.4 P4.4 U1.B5(VDD_0P6) U1.E2(VDD_0P6)
M3_VCC_1P2: C23.2 P2.6 P4.2 U1.A5(VDD_1P2) U1.D1(VDD_1P2)
M3_VCC_BAT: C24.2 P2.8 U1.A6(VDD_BAT) U1.D2(VDD_BAT) U1.E3(VDD_BAT)
M3_VCC_SOL: C21.2 P2.2 U1.A4(VDD_SOLAR) U1.G3(VDD_SOLAR)
VCC_0P6: P2.3
VCC_1P2: P2.5 P5.6
VCC_BAT: P2.7 P5.2 P5.4
VCC_SOL: P2.1
DISCRETE_SCL: P7.6(B2) ; off-sheet DISCRETE_SCL
DISCRETE_SDA: P7.3(B1) ; off-sheet DISCRETE_SDA
FPGA_IO_0: P6.1 ; off-sheet FPGA_IO_0
FPGA_IO_1: P6.3 ; off-sheet FPGA_IO_1
FPGA_IO_2: P6.5 ; off-sheet FPGA_IO_2
FPGA_IO_3: P6.7 ; off-sheet FPGA_IO_3
FPGA_IO_4: P6.9 ; off-sheet FPGA_IO_4
FPGA_IO_5: P6.11 ; off-sheet FPGA_IO_5
FPGA_IO_6: P6.13 ; off-sheet FPGA_IO_6
FPGA_IO_7: P6.15 ; off-sheet FPGA_IO_7
FPGA_IO_8: P6.17 ; off-sheet FPGA_IO_8
FPGA_IO_9: P6.19 ; off-sheet FPGA_IO_9
FPGA_IO_10: P6.21 ; off-sheet FPGA_IO_10
FPGA_IO_11: P6.23 ; off-sheet FPGA_IO_11
FPGA_IO_12: P6.25 ; off-sheet FPGA_IO_12
FPGA_IO_13: P6.27 ; off-sheet FPGA_IO_13
FPGA_IO_14: P6.29 ; off-sheet FPGA_IO_14
FPGA_IO_15: P6.31 ; off-sheet FPGA_IO_15
FPGA_IO_16: P6.33 ; off-sheet FPGA_IO_16
FPGA_IO_17: P6.35 ; off-sheet FPGA_IO_17
FPGA_IO_18: P6.37 ; off-sheet FPGA_IO_18
FPGA_IO_19: P6.39 ; off-sheet FPGA_IO_19
FPGA_IO_20: P6.41 ; off-sheet FPGA_IO_20
FPGA_IO_21: P6.43 ; off-sheet FPGA_IO_21
FPGA_IO_22: P6.45 ; off-sheet FPGA_IO_22
FPGA_IO_23: P6.47 ; off-sheet FPGA_IO_23
FPGA_PINT_CLK: R81.1 ; off-sheet FPGA_PINT_CLK
FPGA_PINT_RDDATA: R83.1 ; off-sheet FPGA_PINT_RDDATA
FPGA_PINT_RDRDY: R82.1 ; off-sheet FPGA_PINT_RDRDY
FPGA_PINT_RDREQ: R84.1 ; off-sheet FPGA_PINT_RDREQ
FPGA_PINT_RESETN: R85.1 ; off-sheet FPGA_PINT_RESETN
FPGA_PINT_WRDATA: R80.1 ; off-sheet FPGA_PINT_WRDATA
FPGA_PINT_WRREQ: R79.1 ; off-sheet FPGA_PINT_WRREQ
FPGA_SPI_CLKOUT: P15.3 ; off-sheet FPGA_SPI_CLKOUT
FPGA_SPI_FSSOUT: P15.5 ; off-sheet FPGA_SPI_FSSOUT
FPGA_SPI_RXD: P15.7 ; off-sheet FPGA_SPI_RXD
FPGA_SPI_TXD: P15.1 ; off-sheet FPGA_SPI_TXD
NetC58_2: C58.2 P5.5 U2.A5(VDD_1P2) U2.J5(VDD_1P2)
NetC59_2: C59.2 P5.3 U2.D9(VDD_ABUF)
NetC60_2: C60.2 P5.1 U2.D10(VDD_BAT) U2.K6(VDD_BAT)
NetP4_1: P4.1 U2.D1(M3_VDD_1P2)
NetP4_3: P4.3 U2.D2(M3_VDD_0P6)
NetP6_2: P6.2 R17.2
NetP6_4: P6.4 R18.2
NetP6_6: P6.6 R19.2
NetP6_8: P6.8 R20.2
NetP6_10: P6.10 R21.2
NetP6_12: P6.12 R22.2
NetP6_14: P6.14 R23.2
NetP6_16: P6.16 R24.2
NetP6_18: P6.18 R25.2
NetP6_20: P6.20 R26.2
NetP6_22: P6.22 R27.2
NetP6_24: P6.24 R28.2
NetP6_26: P6.26 R29.2
NetP6_28: P6.28 R30.2
NetP6_30: P6.30 R31.2
NetP6_32: P6.32 R32.2
NetP6_34: P6.34 R33.2
NetP6_36: P6.36 R34.2
NetP6_38: P6.38 R35.2
NetP6_40: P6.40 R36.2
NetP6_42: P6.42 R37.2
NetP6_44: P6.44 R38.2
NetP6_46: P6.46 R39.2
NetP6_48: P6.48 R40.2
NetP7_1: P7.1(A1) U2.F1(SDA)
NetP7_2: P7.2(O1) R41.2
NetP7_4: P7.4(A2) U2.F2(SCL)
NetP7_5: P7.5(O2) R42.2
NetP15_2: P15.2 R73.2
NetP15_4: P15.4 R74.2
NetP15_6: P15.6 R75.2
NetP15_8: P15.8 R76.2
NetR17_1: R17.1 U1.K4(GPIO_0)
NetR18_1: R18.1 U1.L4(GPIO_1)
NetR19_1: R19.1 U1.J5(GPIO_2)
NetR20_1: R20.1 U1.K5(GPIO_3)
NetR21_1: R21.1 U1.L5(GPIO_4)
NetR22_1: R22.1 U1.K6(GPIO_5)
NetR23_1: R23.1 U1.J6(GPIO_6)
NetR24_1: R24.1 U1.J7(GPIO_7)
NetR25_1: R25.1 U1.L7(GPIO_8)
NetR26_1: R26.1 U1.K7(GPIO_9)
NetR27_1: R27.1 U1.L6(GPIO_10)
NetR28_1: R28.1 U1.L8(GPIO_11)
NetR29_1: R29.1 U1.K8(GPIO_12)
NetR30_1: R30.1 U1.B10(GPIO_13)
NetR31_1: R31.1 U1.B9(GPIO_14)
NetR32_1: R32.1 U1.A10(GPIO_15)
NetR33_1: R33.1 U1.A9(GPIO_16)
NetR34_1: R34.1 U1.B8(GPIO_17)
NetR35_1: R35.1 U1.A8(GPIO_18)
NetR36_1: R36.1 U1.B6(GPIO_19)
NetR37_1: R37.1 U1.B7(GPIO_20)
NetR38_1: R38.1 U1.A7(GPIO_21)
NetR39_1: R39.1 U1.C7(GPIO_22)
NetR40_1: R40.1 U1.C6(GPIO_23)
NetR41_1: R41.1 U1.E1(SDA)
NetR42_1: R42.1 U1.F3(SCL)
NetR73_1: R73.1 U1.L3(SPI_TXD)
NetR74_1: R74.1 U1.L2(SPI_CLKOUT)
NetR75_1: R75.1 U1.K3(SPI_FSSOUT)
NetR76_1: R76.1 U1.K2(SPI_RXD)
NetR79_2: R79.2 U2.E9(PC_WRREQ)
NetR80_2: R80.2 U2.E10(PC_WRDATA)
NetR81_2: R81.2 U2.F9(PC_CLK)
NetR82_2: R82.2 U2.F10(PC_RDRDY_OUT)
NetR83_2: R83.2 U2.G10(PC_RDDATA_OUT)
NetR84_2: R84.2 U2.J7(PC_RDREQ)
NetR85_2: R85.2 U2.K7(PC_RESETN)
NetTP2_1: TP2.1(A) U2.B4(M3_VDD_IP2_OUT)
NetTP3_1: TP3.1(A) U2.A6(ANA_OUT0)
NetTP4_1: TP4.1(A) U2.E1(SDA_AOUT)
NetTP5_1: TP5.1(A) U2.K4(SCL_DOUT)
NetTP6_1: TP6.1(A) U2.A4(M3_VDD_0P6_OUT)
NetTP7_1: TP7.1(A) U2.B6(ANA_OUT1)
NetTP8_1: TP8.1(A) U2.E2(SCL_AOUT)
NetTP9_1: TP9.1(A) U2.K5(SDA_DOUT)
NetTP10_1: TP10.1(A) U2.B7(ANA_IN0)
NetTP11_1: TP11.1(A) U2.A7(ANA_IN1)

### Notes on the sheet
- PINT (Programming INTerface chip)
- M3 (Michigan Millimeter Mote)
- M3 ICE: PINT & M3 Chips

### Library data of the parts
C21-C23 = Cap Semi: Capacitor (Semiconductor SIM Model); DistPartNo: 399-7893-1-ND; ManPartNo: C0603C302K5GACTU; Published: 8-Jun-2000; LatestRevisionDate: 29-May-2009; LatestRevisionNote: IPC-7351 Footprint Added.; PackageReference: C1206; Publisher: Altium Limited; PackageDescription: Chip Capacitor
C24 C58-C60 = Cap Semi: Capacitor (Semiconductor SIM Model); DistPartNo: 445-1317-1-ND; ManPartNo: C1608X7R1C104K; Published: 8-Jun-2000; LatestRevisionDate: 29-May-2009; LatestRevisionNote: IPC-7351 Footprint Added.; PackageReference: C1206; Publisher: Altium Limited; PackageDescription: Chip Capacitor
P2 P15 = Header 4X2: Header, 4-Pin, Dual row; LatestRevisionDate: 17-Jul-2002; LatestRevisionNote: Re-released for DXP Platform.; Publisher: Altium Limited
P4 = Header 2X2: Header, 2-Pin, Dual row; LatestRevisionDate: 17-Jul-2002; LatestRevisionNote: Re-released for DXP Platform.; Publisher: Altium Limited
P5 = Header 3X2: Header, 3-Pin, Dual row; LatestRevisionDate: 17-Jul-2002; LatestRevisionNote: Re-released for DXP Platform.; Publisher: Altium Limited
P6 = Header 24X2: Header, 24-Pin, Dual row; LatestRevisionDate: 17-Jul-2002; LatestRevisionNote: Re-released for DXP Platform.; Publisher: Altium Limited
R17-R40 R73-R76 R79-R85 = Res Chip: Semiconductor Resistor; DistPartNo: P47GCT-ND; ManPartNo: ERJ-3GEYJ470V; Published: 8-Jun-2000; LatestRevisionDate: 17-Jul-2002; LatestRevisionNote: Re-released for DXP Platform.; PackageReference: AXIAL-0.5; Publisher: Altium Limited; PackageDescription: Axial Device, Thru-Hole; 2 Leads; 0.5 in Pin Spacing
R41 R42 = Res Chip: Semiconductor Resistor; DistPartNo: P0.0GCT-ND; ManPartNo: ERJ-3GEY0R00V; Published: 8-Jun-2000; LatestRevisionDate: 17-Jul-2002; LatestRevisionNote: Re-released for DXP Platform.; PackageReference: AXIAL-0.5; Publisher: Altium Limited; PackageDescription: Axial Device, Thru-Hole; 2 Leads; 0.5 in Pin Spacing
U1 = M3: DistPartNo: 3M5067-ND; ManPartNo: 200-6311-9UN-1900
U2 = PINT: DistPartNo: 3M5066-ND; ManPartNo: 200-6310-9UN-1900

## Sheet M3_Discrete_Interface.SchDoc
size A
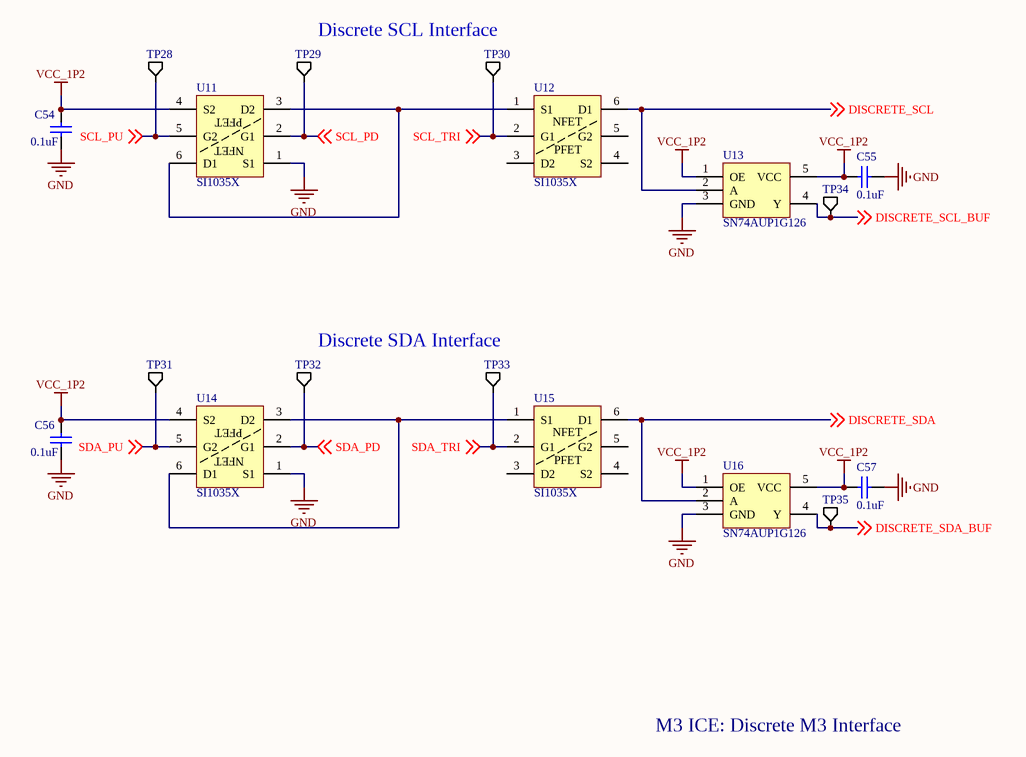
[diagram p5: M3_Discrete_Interface.SchDoc]

### Parts
C54  value 0.1uF  [1608[0603]]  (hidden comment: Cap Semi)
C55  value 0.1uF  [1608[0603]]  (hidden comment: Cap Semi)
C56  value 0.1uF  [1608[0603]]  (hidden comment: Cap Semi)
C57  value 0.1uF  [1608[0603]]  (hidden comment: Cap Semi)
TP28  TP  [TP]  (value not drawn)
TP29  TP  [TP]  (value not drawn)
TP30  TP  [TP]  (value not drawn)
TP31  TP  [TP]  (value not drawn)
TP32  TP  [TP]  (value not drawn)
TP33  TP  [TP]  (value not drawn)
TP34  TP  [TP]  (value not drawn)
TP35  TP  [TP]  (value not drawn)
U11  SI1035X  [SC-89-6]
U12  SI1035X  [SC-89-6]
U13  SN74AUP1G126  [SOT-753]
U14  SI1035X  [SC-89-6]
U15  SI1035X  [SC-89-6]
U16  SN74AUP1G126  [SOT-753]

### Nets
GND: C54.1 C55.1 C56.1 C57.1 U11.1(S1) U13.3(GND) U14.1(S1) U16.3(GND)
VCC_1P2: C54.2 C55.2 C56.2 C57.2 U11.4(S2) U13.1(OE) U13.5(VCC) U14.4(S2) U16.1(OE) U16.5(VCC)
DISCRETE_SCL: U12.6(D1) U13.2(A) ; off-sheet DISCRETE_SCL
DISCRETE_SCL_BUF: TP34.1(A) U13.4(Y) ; off-sheet DISCRETE_SCL_BUF
DISCRETE_SDA: U15.6(D1) U16.2(A) ; off-sheet DISCRETE_SDA
DISCRETE_SDA_BUF: TP35.1(A) U16.4(Y) ; off-sheet DISCRETE_SDA_BUF
SCL_PD: TP29.1(A) U11.2(G1) ; off-sheet SCL_PD
SCL_PU: TP28.1(A) U11.5(G2) ; off-sheet SCL_PU
SCL_TRI: TP30.1(A) U12.2(G1) ; off-sheet SCL_TRI
SDA_PD: TP32.1(A) U14.2(G1) ; off-sheet SDA_PD
SDA_PU: TP31.1(A) U14.5(G2) ; off-sheet SDA_PU
SDA_TRI: TP33.1(A) U15.2(G1) ; off-sheet SDA_TRI
NetU11_3: U11.3(D2) U11.6(D1) U12.1(S1)
NetU14_3: U14.3(D2) U14.6(D1) U15.1(S1)

Not connected (* = marked no-connect by the designer): U12 3(D2) 4(S2) 5(G2); U15 3(D2) 4(S2) 5(G2)

### Notes on the sheet
- Discrete SCL Interface
- Discrete SDA Interface
- M3 ICE: Discrete M3 Interface
- (in symbol SI1035X) PFET; NFET

### Library data of the parts
C54-C57 = Cap Semi: as C24 on sheet M3_Chip; Published: 8-Jun-2000; LatestRevisionDate: 29-May-2009; LatestRevisionNote: IPC-7351 Footprint Added.; PackageReference: C1206; Publisher: Altium Limited; PackageDescription: Chip Capacitor
U11 U12 U14 U15 = SI1035X: Complementary N- and P-Channel 20 V (D-S) MOSFET; DistPartNo: SI1035X-T1-GE3CT-ND; ManPartNo: SI1035X-T1-GE3
U13 U16 = SN74AUP1G126: LOW-POWER SINGLE BUS BUFFER GATE WITH 3-STATE OUTPUT; DistPartNo: 296-18005-1-ND; ManPartNo: SN74AUP1G126DBVR

## Nets that join several sheets
GND: FPGA_IO (21 pins), Power (35 pins), FPGA_misc (36 pins), USB_to_UART (18 pins), M3_Chip (11 pins), M3_Discrete_Interface (8 pins)
VCC_0P6: Power (5 pins), M3_Chip (P2.3)
VCC_1P2: Power (5 pins), FPGA_misc (21 pins), M3_Chip (P2.5 P5.6), M3_Discrete_Interface (10 pins)
VCC_B0: FPGA_IO (12 pins), Power (5 pins), FPGA_misc (14 pins)
VCC_BAT: Power (12 pins), M3_Chip (P2.7 P5.2 P5.4)
VCC_USB: Power (Q1.2 TP19.1 U4.1), USB_to_UART (11 pins)
DISCRETE_SCL: M3_Chip (P7.6), M3_Discrete_Interface (U12.6 U13.2)
DISCRETE_SCL_BUF: FPGA_IO (F1.8), M3_Discrete_Interface (TP34.1 U13.4)
DISCRETE_SDA: M3_Chip (P7.3), M3_Discrete_Interface (U15.6 U16.2)
DISCRETE_SDA_BUF: FPGA_IO (F1.7), M3_Discrete_Interface (TP35.1 U16.4)
FPGA_IO_0: FPGA_IO (F1.63), M3_Chip (P6.1)
FPGA_IO_1: FPGA_IO (F1.62), M3_Chip (P6.3)
FPGA_IO_2: FPGA_IO (F1.61), M3_Chip (P6.5)
FPGA_IO_3: FPGA_IO (F1.60), M3_Chip (P6.7)
FPGA_IO_4: FPGA_IO (F1.59), M3_Chip (P6.9)
FPGA_IO_5: FPGA_IO (F1.58), M3_Chip (P6.11)
FPGA_IO_6: FPGA_IO (F1.57), M3_Chip (P6.13)
FPGA_IO_7: FPGA_IO (F1.45), M3_Chip (P6.15)
FPGA_IO_8: FPGA_IO (F1.44), M3_Chip (P6.17)
FPGA_IO_9: FPGA_IO (F1.43), M3_Chip (P6.19)
FPGA_IO_10: FPGA_IO (F1.42), M3_Chip (P6.21)
FPGA_IO_11: FPGA_IO (F1.41), M3_Chip (P6.23)
FPGA_IO_12: FPGA_IO (F1.40), M3_Chip (P6.25)
FPGA_IO_13: FPGA_IO (F1.36), M3_Chip (P6.27)
FPGA_IO_14: FPGA_IO (F1.35), M3_Chip (P6.29)
FPGA_IO_15: FPGA_IO (F1.34), M3_Chip (P6.31)
FPGA_IO_16: FPGA_IO (F1.33), M3_Chip (P6.33)
FPGA_IO_17: FPGA_IO (F1.32), M3_Chip (P6.35)
FPGA_IO_18: FPGA_IO (F1.31), M3_Chip (P6.37)
FPGA_IO_19: FPGA_IO (F1.30), M3_Chip (P6.39)
FPGA_IO_20: FPGA_IO (F1.29), M3_Chip (P6.41)
FPGA_IO_21: FPGA_IO (F1.28), M3_Chip (P6.43)
FPGA_IO_22: FPGA_IO (F1.27), M3_Chip (P6.45)
FPGA_IO_23: FPGA_IO (F1.26), M3_Chip (P6.47)
FPGA_PINT_CLK: FPGA_IO (F1.69), M3_Chip (R81.1)
FPGA_PINT_RDDATA: FPGA_IO (F1.71), M3_Chip (R83.1)
FPGA_PINT_RDRDY: FPGA_IO (F1.70), M3_Chip (R82.1)
FPGA_PINT_RDREQ: FPGA_IO (F1.72), M3_Chip (R84.1)
FPGA_PINT_RESETN: FPGA_IO (F1.73), M3_Chip (R85.1)
FPGA_PINT_WRDATA: FPGA_IO (F1.65), M3_Chip (R80.1)
FPGA_PINT_WRREQ: FPGA_IO (F1.64), M3_Chip (R79.1)
FPGA_SPI_CLKOUT: FPGA_IO (F1.22), M3_Chip (P15.3)
FPGA_SPI_FSSOUT: FPGA_IO (F1.21), M3_Chip (P15.5)
FPGA_SPI_RXD: FPGA_IO (F1.20), M3_Chip (P15.7)
FPGA_SPI_TXD: FPGA_IO (F1.23), M3_Chip (P15.1)
SCL_PD: FPGA_IO (F1.15), M3_Discrete_Interface (TP29.1 U11.2)
SCL_PU: FPGA_IO (F1.19), M3_Discrete_Interface (TP28.1 U11.5)
SCL_TRI: FPGA_IO (F1.11), M3_Discrete_Interface (TP30.1 U12.2)
SDA_PD: FPGA_IO (F1.13), M3_Discrete_Interface (TP32.1 U14.2)
SDA_PU: FPGA_IO (F1.16), M3_Discrete_Interface (TP31.1 U14.5)
SDA_TRI: FPGA_IO (F1.10), M3_Discrete_Interface (TP33.1 U15.2)
SYS_CLK: FPGA_IO (F1.98), FPGA_misc (TP1.1 X1.3)
USB_UART_RXD: FPGA_IO (F1.97), USB_to_UART (TP26.1 U9.25)
USB_UART_TXD: FPGA_IO (F1.96), USB_to_UART (TP27.1 U9.26)